# Altium schematic sheet XBEE.SchDoc
size A; SheetNumber: 6; SheetTotal: 10
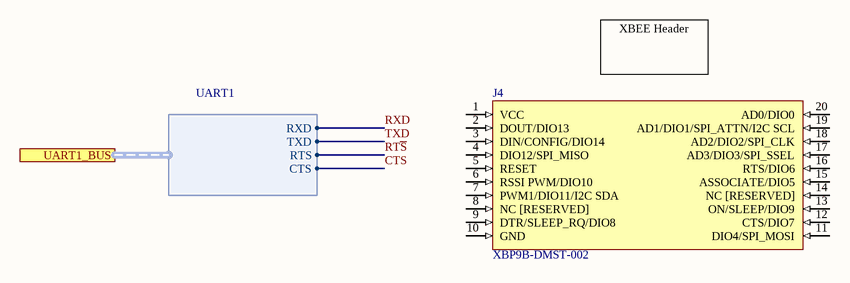
[diagram p0: XBEE.SchDoc]

## Parts
J4  XBP9B-DMST-002  [XBP9B-DMST-002-Footprint-1]

## Ports
UART1_BUS (harness UART1)

## Harnesses
UART1: RXD, TXD, RTS, CTS

## Nets
CTS: port UART1_BUS.CTS
RT~{S}: port UART1_BUS.RTS
RXD: port UART1_BUS.RXD
TXD: port UART1_BUS.TXD

Not connected (* = marked no-connect by the designer): J4 1(VCC) 2(DOUT/DIO13) 3(DIN/CONFIG/DIO14) 4(DIO12/SPI_MISO) 5(RESET) 6(RSSI_PWM/DIO10) 7(PWM1/DIO11/I2C_SDA) 8(NC_[RESERVED]) 9(DTR/SLEEP_RQ/DIO8) 10(GND) 11(DIO4/SPI_MOSI) 12(CTS/DIO7) 13(ON/SLEEP/DIO9) 14(NC_[RESERVED]) 15(ASSOCIATE/DIO5) 16(RTS/DIO6) 17(AD3/DIO3/SPI_SSEL) 18(AD2/DIO2/SPI_CLK) 19(AD1/DIO1/SPI_ATTN/I2C_SCL) 20(AD0/DIO0)

## Notes on the sheet
- (near J4) XBEE Header

## Library data of the parts
J4 = CMP-00025-00003-1: 802.15.4 LR-WPAN SOC 928MHz 200Kbps